# Altium schematic sheet 08-USB.SchDoc
size A4
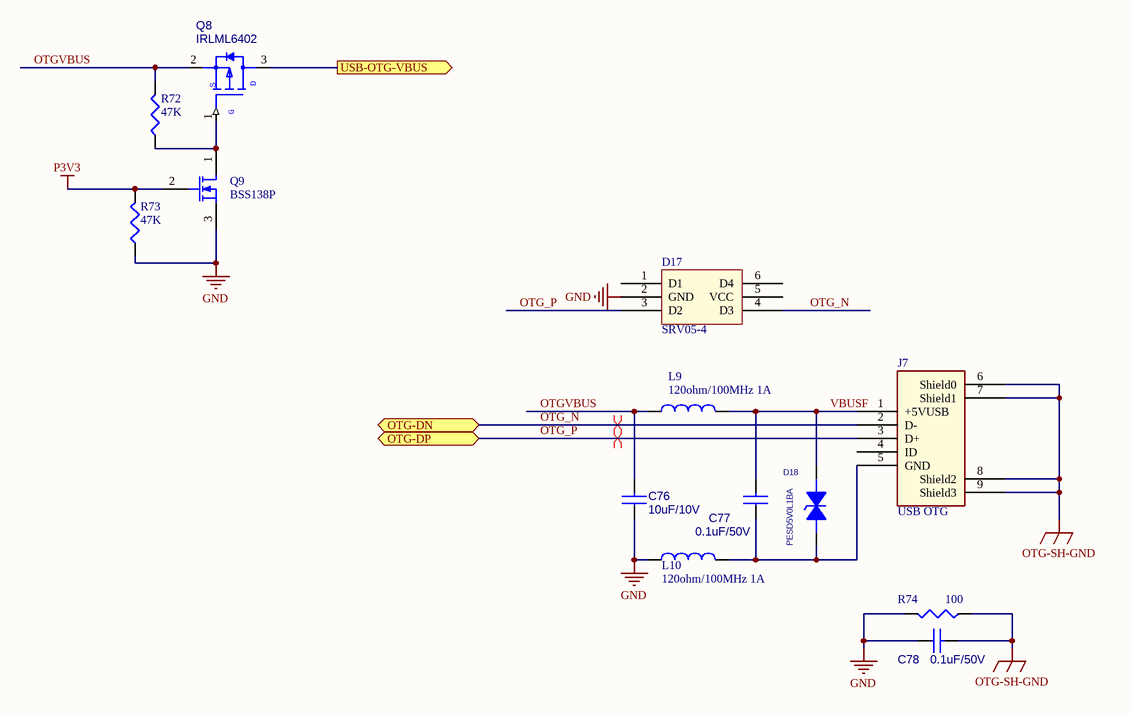
[diagram p0: 08-USB.SchDoc]

## Parts
C76  10uF/10V  [0805]
C77  0.1uF/50V  [0402]
C78  0.1uF/50V  [0402]
D17  SRV05-4  [SOT23-6]
D18  PESD5V0L1BA  [SOD323]
J7  USB OTG  [MINIUSB-TYPEAB]
L9  120ohm/100MHz 1A  [0603]
L10  120ohm/100MHz 1A  [0603]
Q8  IRLML6402  [MOSFET]
Q9  BSS138P  [NPN]
R72  47K  [0402]
R73  47K  [0402]
R74  100  [0402]

## Ports
OTG-DN, OTG-DP (bidir), USB-OTG-VBUS (out)

## Nets
GND: C76.1 C78.1 D17.2(GND) L10.1 Q9.3(S) R73.1 R74.2
OTG-SH-GND: C78.2 J7.6(Shield0) J7.7(Shield1) J7.8(Shield2) J7.9(Shield3) R74.1
P3V3: Q9.2(G) R73.2
OTG_N: D17.4(D3) J7.2(D-) ; port OTG-DN
OTG_P: D17.3(D2) J7.3(D+) ; port OTG-DP
OTGVBUS: C76.2 L9.1 Q8.2(S) R72.2
USB-OTG-VBUS: Q8.3(D) ; port USB-OTG-VBUS
VBUSF: C77.2 D18.2 J7.1(+5VUSB) L9.2
NetC77_1: C77.1 D18.1 J7.5(GND) L10.2
NetQ8_1: Q8.1(G) Q9.1(D) R72.1

Not connected (* = marked no-connect by the designer): D17 1(D1) 5(VCC) 6(D4); J7 4(ID)

## Layout directives
differential pair: OTG_N, OTG_P

## Library data of the parts
C76-C78 = CAP_Dup1
D18 = PESD
J7 = FOX_UH51543-JS7: Part Number: SP063100800; NC: 10,11; ROOM: USB
L9 L10 = Inductor: Code_IEC: 1005; Value: 300ohm/100MHz BEAD; Published: 8-Jun-2000; LatestRevisionDate: 29-May-2009; LatestRevisionNote: IPC-7351 Footprint Added.; PackageReference: 0402-A; Publisher: Altium Limited; PackageDescription: Chip Inductor; Code_JEITA: 0402
Q8 = AO3401L_SOT23-3_0: Part Number: SB934010010; ROOM: USB POWER; Part Value: AO3401L_SOT23-3
Q9 = MOSFET-N: N-Channel MOSFET; Published: 8-Jun-2000; LatestRevisionDate: 17-Jul-2002; LatestRevisionNote: Re-released for DXP Platform.; PackageVersion: 1995/1996; PackageReference: E3; Publisher: Altium Limited; PackageDescription: TO, Flat Index; 3 In-Line, Axial Leads; Body Dia. 4.6mm; Lead Dia. 0.5 mm (max)
R72-R74 = CR16-1003FM